# EAGLE schematic morkscam (EAGLE 9.6.2)
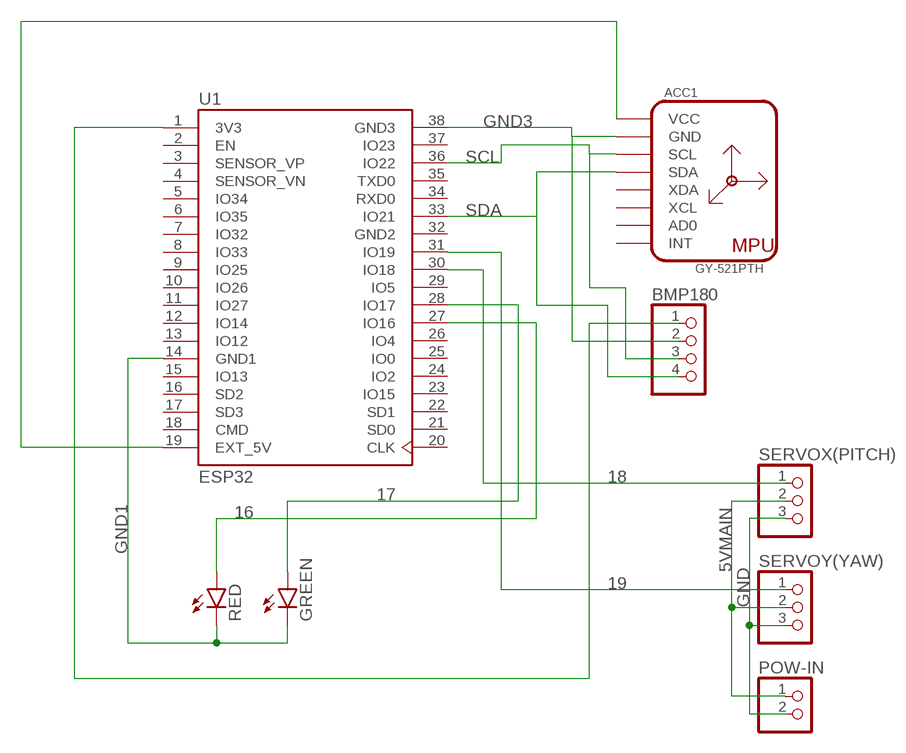
[diagram p0: schematic, sheet 1]

## Parts
ACC1  GY-521PTH  [GY-521]
BMP180  PINHD-1X4  [1X04]
GREEN  LED3MM  [LED3MM]
POW-IN  PINHD-1X2  [1X02]
RED  LED3MM  [LED3MM]
SERVOX(PITCH)  PINHD-1X3  [1X03]
SERVOY(YAW)  PINHD-1X3  [1X03]
U1  ESP32  [MODULE_ESP32-DEVKITC]

## Nets
3.3V: BMP180.1 U1.1(3V3)
5VMAIN: POW-IN.1 SERVOX(PITCH).2 SERVOY(YAW).2
16: RED.A U1.27(IO16)
17: GREEN.A U1.28(IO17)
18: SERVOX(PITCH).1 U1.30(IO18)
19: SERVOY(YAW).1 U1.31(IO19)
GND: POW-IN.2 SERVOX(PITCH).3 SERVOY(YAW).3
GND1: GREEN.K(C) RED.K(C) U1.14(GND1)
GND3: ACC1.GND BMP180.2 U1.38(GND3)
N$3: ACC1.VCC U1.19(EXT_5V)
SCL: ACC1.SCL BMP180.3 U1.36(IO22)
SDA: ACC1.SDA BMP180.4 U1.33(IO21)
Unconnected: ACC1.AD0 ACC1.INT ACC1.XCL ACC1.XDA U1.2(EN) U1.3(SENSOR_VP) U1.4(SENSOR_VN) U1.5(IO34) U1.6(IO35) U1.7(IO32) U1.8(IO33) U1.9(IO25) U1.10(IO26) U1.11(IO27) U1.12(IO14) U1.13(IO12) U1.15(IO13) U1.16(SD2) U1.17(SD3) U1.18(CMD) U1.20(CLK) U1.21(SD0) U1.22(SD1) U1.23(IO15) U1.24(IO2) U1.25(IO0) U1.26(IO4) U1.29(IO5) U1.34(RXD0) U1.35(TXD0) U1.37(IO23)

## Power pins joined to a net without a drawn wire
GND2: U1.32(GND2)

## Library data of the parts
ACC1 = GY-521:GY-521: Check availability <https://pricing.snapeda.com/parts/GY-521/GODREAM%20FORDREAM%20CO.%2C%20LIMITED/view-part?ref=eda>; AVAILABILITY: Not in stock; CHECK_PRICES: https://www.snapeda.com/parts/GY-521/GODREAM+FORDREAM+CO.%252C+LIMITED/view-part/?ref=eda; DESCRIPTION: Triple Axis Accelerometer Gyro Breakout; MF: GODREAM FORDREAM CO., LIMITED; MP: GY-521; PACKAGE: Package; PRICE: None; SNAPEDA_LINK: https://www.snapeda.com/parts/GY-521/GODREAM+FORDREAM+CO.%252C+LIMITED/view-part/?ref=snap
BMP180 = pinhead:PINHD-1X4: PIN HEADER
GREEN RED = led:LED: LED OSRAM: - CHIPLED LG R971, LG N971, LY N971, LG Q971, LY Q971, LO R971, LY R971 LH N974, LH R974 LS Q976, LO Q976, LY Q976 LO Q996 - Hyper CHIPLED LW Q18S LB Q993, LB Q99A, LB R99A - SideLED LS A670, LO A670, LY A670, LG A670, LP A670 LB A673, LV A673, LT A673, LW A673 LH A674 LY A675 LS A676, LA A676, LO A676, LY A676, LW A676 LS A679, LY A679, LG A679 - Hyper Micro SIDELED® LS Y876, LA Y876, LO Y876, LY Y876 LT Y87S - SmartLED LW L88C, LW L88S LB L89C, LB L89S, LG L890 LS L89K, LO L89K, LY L89K LS L896, LA L896, LO L896, LY L896 - TOPLED LS T670, LO T670, LY T670, LG T670, LP T670 LSG T670, LSP T670, LSY T670, LOP T670, LYG T670 LG T671, LOG T671, LSG T671 LB T673, LV T673, LT T673, LW T673 LH T674 LS T676, LA T676, LO T676, LY T676, LB T676, LH T676, LSB T676, LW T676 LB T67C, LV T67C, LT T67C, LS T67K, LO T67K, LY T67K, LW E67C LS E67B, LA E67B, LO E67B, LY E67B, LB E67C, LV E67C, LT E67C LW T67C LS T679, LY T679, LG T679 LS T770, LO T770, LY T770, LG T770, LP T770 LB T773, LV T773, LT T773, LW T773 LH T774 LS E675, LA E675, LY E675, LS T675 LS T776, LA T776, LO T776, LY T776, LB T776 LHGB T686 LT T68C, LB T68C - Hyper Mini TOPLED® LB M676 - Mini TOPLED Santana® LG M470 LS M47K, LO M47K, LY M47K Source: http://www.osram.convergy.de LUXEON: - LUMILED® LXK2-PW12-R00, LXK2-PW12-S00, LXK2-PW14-U00, LXK2-PW14-V00 LXK2-PM12-R00, LXK2-PM12-S00, LXK2-PM14-U00 LXK2-PE12-Q00, LXK2-PE12-R00, LXK2-PE12-S00, LXK2-PE14-T00, LXK2-PE14-U00 LXK2-PB12-K00, LXK2-PB12-L00, LXK2-PB12-M00, LXK2-PB14-N00, LXK2-PB14-P00, LXK2-PB14-Q00 LXK2-PR12-L00, LXK2-PR12-M00, LXK2-PR14-Q00, LXK2-PR14-R00 LXK2-PD12-Q00, LXK2-PD12-R00, LXK2-PD12-S00 LXK2-PH12-R00, LXK2-PH12-S00 LXK2-PL12-P00, LXK2-PL12-Q00, LXK2-PL12-R00 Source: www.luxeon.com KINGBRIGHT: KA-3528ASYC Source: www.kingbright.com
POW-IN = pinhead:PINHD-1X2: PIN HEADER
SERVOX(PITCH) SERVOY(YAW) = pinhead:PINHD-1X3: PIN HEADER
U1 = ESP32-DEVKITC:ESP32: Check availability <https://pricing.snapeda.com/parts/ESP32-DEVKITC/Espressif%20Systems/view-part?ref=eda>; AVAILABILITY: In Stock; CHECK_PRICES: https://www.snapeda.com/parts/ESP32-DEVKITC/Espressif+Systems/view-part/?ref=eda; DESCRIPTION: ESP32-WROOM-32UE series Transceiver; 802.11 b/g/n (Wi-Fi, WiFi, WLAN), Bluetooth ® Smart Ready 4.x Dual Mode Evaluation Board; MF: Espressif Systems; MP: ESP32-DEVKITC; PACKAGE: None; PRICE: None; PURCHASE-URL: https://www.snapeda.com/api/url_track_click_mouser/?unipart_id=5168535&manufacturer=Espressif Systems&part_name=ESP32-DEVKITC&search_term=None; SNAPEDA_LINK: https://www.snapeda.com/parts/ESP32-DEVKITC/Espressif+Systems/view-part/?ref=snap